# Altium schematic sheet Sheet2.SchDoc
size A2; Organization: Altium Limited; Address1: L3, 12a Rodborough Rd; Address2: Frenchs Forest; Address3: NSW; Address4: Australia 2086
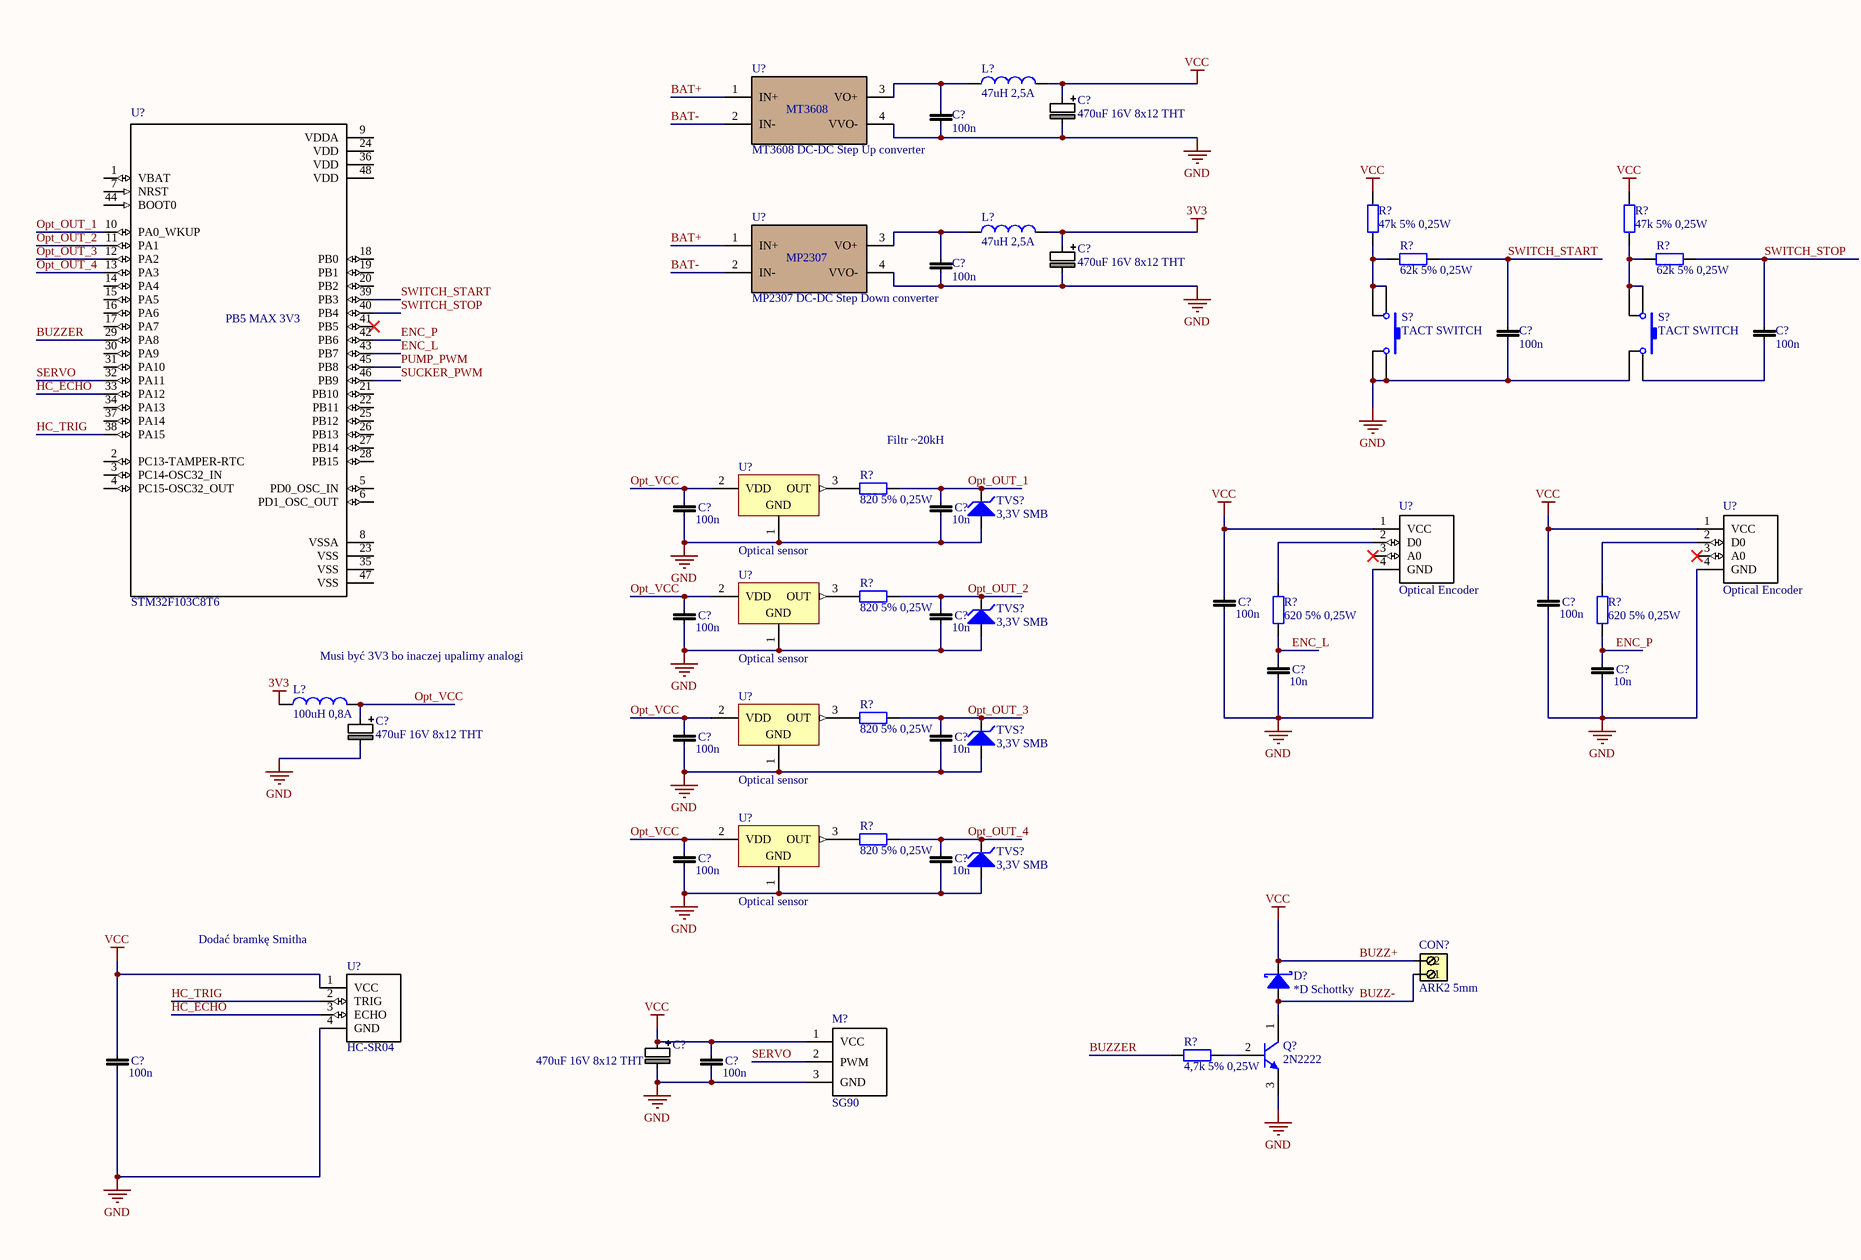
[diagram p0: Sheet2.SchDoc, left]
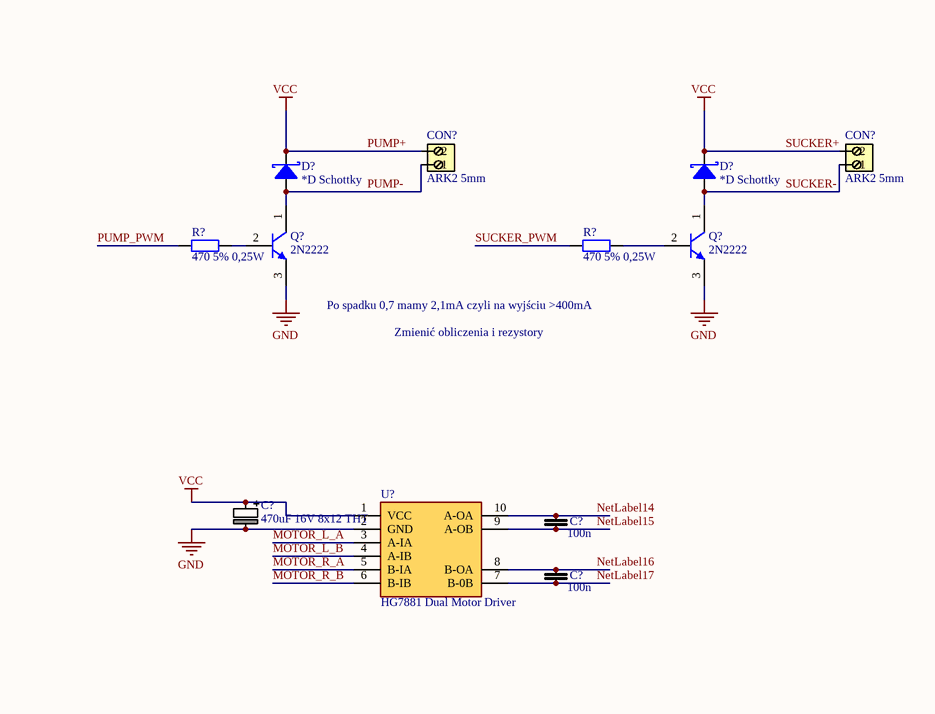
[diagram p1: Sheet2.SchDoc, right]

## Parts
(Parts that share a designator on the sheet are numbered #1, #2 ... from top to bottom, then left to right.)
C?#1  470uF 16V 8x12 THT  [EL8x12]
C?#2  100n  [C THT  FILM X2]
C?#3  470uF 16V 8x12 THT  [EL8x12]
C?#4  100n  [C THT  FILM X2]
C?#5  100n  [C THT  FILM X2]
C?#6  100n  [C THT  FILM X2]
C?#7  100n  [C THT  FILM X2]
C?#8  10n  [C THT  FILM X2]
C?#9  470uF 16V 8x12 THT  [EL8x12]
C?#10  100n  [C THT  FILM X2]
C?#11  100n  [C THT  FILM X2]
C?#12  100n  [C THT  FILM X2]
C?#13  100n  [C THT  FILM X2]
C?#14  10n  [C THT  FILM X2]
C?#15  100n  [C THT  FILM X2]
C?#16  10n  [C THT  FILM X2]
C?#17  10n  [C THT  FILM X2]
C?#18  470uF 16V 8x12 THT  [EL8x12]
C?#19  100n  [C THT  FILM X2]
C?#20  10n  [C THT  FILM X2]
C?#21  100n  [C THT  FILM X2]
C?#22  10n  [C THT  FILM X2]
C?#23  470uF 16V 8x12 THT  [EL8x12]
C?#24  100n  [C THT  FILM X2]
C?#25  100n  [C THT  FILM X2]
CON?#1  ARK2 5mm  [ARK5-2]
CON?#2  ARK2 5mm  [ARK5-2]
CON?#3  ARK2 5mm  [ARK5-2]
D?#1  *D Schottky  [SMA]
D?#2  *D Schottky  [SMA]
D?#3  *D Schottky  [SMA]
L?#1  47uH 2,5A  [MSS1278 SERIES]
L?#2  47uH 2,5A  [MSS1278 SERIES]
L?#3  100uH 0,8A  [MSS1278 SERIES]
M?  SG90
Q?#1  2N2222  [ONSC-TO-92-3-29-11]
Q?#2  2N2222  [ONSC-TO-92-3-29-11]
Q?#3  2N2222  [ONSC-TO-92-3-29-11]
R?#1  47k 5% 0,25W  [RES-15mm_0.25W]
R?#2  47k 5% 0,25W  [RES-15mm_0.25W]
R?#3  62k 5% 0,25W  [RES-15mm_0.25W]
R?#4  62k 5% 0,25W  [RES-15mm_0.25W]
R?#5  470 5% 0,25W  [RES-15mm_0.25W]
R?#6  470 5% 0,25W  [RES-15mm_0.25W]
R?#7  820 5% 0,25W  [RES-15mm_0.25W]
R?#8  820 5% 0,25W  [RES-15mm_0.25W]
R?#9  620 5% 0,25W  [RES-15mm_0.25W]
R?#10  620 5% 0,25W  [RES-15mm_0.25W]
R?#11  820 5% 0,25W  [RES-15mm_0.25W]
R?#12  820 5% 0,25W  [RES-15mm_0.25W]
R?#13  4,7k 5% 0,25W  [RES-15mm_0.25W]
S?#1  TACT SWITCH  [DTS6]
S?#2  TACT SWITCH  [DTS6]
TVS?#1  3,3V SMB  [SMB]
TVS?#2  3,3V SMB  [SMB]
TVS?#3  3,3V SMB  [SMB]
TVS?#4  3,3V SMB  [SMB]
U?#1  MT3608 DC-DC Step Up converter  [DC_DC_SINGLE]
U?#2  MP2307 DC-DC Step Down converter  [DC_DC_SINGLE]
U?#3  STM32F103C8T6  [*QFP50P900X900X160-48N]
U?#4  Optical sensor  [AMS-S-3-4600X2600_V]
U?#5  Optical Encoder
U?#6  Optical Encoder
U?#7  Optical sensor  [AMS-S-3-4600X2600_V]
U?#8  HG7881 Dual Motor Driver
U?#9  Optical sensor  [AMS-S-3-4600X2600_V]
U?#10  Optical sensor  [AMS-S-3-4600X2600_V]
U?#11  HC-SR04  [*XCVR_HC-SR04]

## Nets
3V3: C?#3.2(+) L?#2.2 L?#3.1
BUZZ+: C?#1.2(+) C?#9.2(+) C?#11.2 C?#12.2 C?#23.2(+) C?#24.2 C?#25.2 CON?#1.2 CON?#2.2 CON?#3.2 D?#1.2(K) D?#2.2(K) D?#3.2(K) L?#1.2 M?.1(VCC) R?#1.2 R?#2.2 U?#5.1(VCC) U?#6.1(VCC) U?#8.1(VCC) U?#11.1(VCC)  [also labelled PUMP+, SUCKER+, VCC]
GND: C?#1.1(-) C?#2.1 C?#3.1(-) C?#4.1 C?#5.1 C?#7.1 C?#8.1 C?#9.1(-) C?#11.1 C?#12.1 C?#13.1 C?#14.1 C?#16.1 C?#17.1 C?#18.1(-) C?#19.1 C?#20.1 C?#21.1 C?#22.1 C?#23.1(-) C?#24.1 C?#25.1 M?.3(GND) Q?#1.3(E) Q?#2.3(E) Q?#3.3(E) S?#1.3 S?#1.4 S?#2.3 TVS?#1.1(A) TVS?#2.1(A) TVS?#3.1(A) TVS?#4.1(A) U?#1.4(VVO-) U?#2.4(VVO-) U?#4.1(GND) U?#5.4(GND) U?#6.4(GND) U?#7.1(GND) U?#8.2(GND) U?#9.1(GND) U?#10.1(GND) U?#11.4(GND)
BAT+: U?#1.1(IN+) U?#2.1(IN+)
BAT-: U?#1.2(IN-) U?#2.2(IN-)
BUZZ-: CON?#3.1 D?#3.1(A) Q?#3.1(C)
BUZZER: R?#13.1 U?#3.29(PA8)
ENC_L: C?#16.2 R?#9.1 U?#3.43(PB7)
ENC_P: C?#17.2 R?#10.1 U?#3.42(PB6)
HC_ECHO: U?#3.33(PA12) U?#11.3(ECHO)
HC_TRIG: U?#3.38(PA15) U?#11.2(TRIG)
MOTOR_L_A: U?#8.3(A-IA)
MOTOR_L_B: U?#8.4(A-IB)
MOTOR_R_A: U?#8.5(B-IA)
MOTOR_R_B: U?#8.6(B-IB)
NetLabel14: C?#10.2 U?#8.10(A-OA)
NetLabel15: C?#10.1 U?#8.9(A-OB)
NetLabel16: C?#15.2 U?#8.8(B-OA)
NetLabel17: C?#15.1 U?#8.7(B-0B)
Opt_OUT_1: C?#8.2 R?#7.2 TVS?#1.2(K) U?#3.10(PA0_WKUP)
Opt_OUT_2: C?#14.2 R?#8.2 TVS?#2.2(K) U?#3.11(PA1)
Opt_OUT_3: C?#20.2 R?#11.2 TVS?#3.2(K) U?#3.12(PA2)
Opt_OUT_4: C?#22.2 R?#12.2 TVS?#4.2(K) U?#3.13(PA3)
Opt_VCC: C?#7.2 C?#13.2 C?#18.2(+) C?#19.2 C?#21.2 L?#3.2 U?#4.2(VDD) U?#7.2(VDD) U?#9.2(VDD) U?#10.2(VDD)
PUMP-: CON?#1.1 D?#1.1(A) Q?#1.1(C)
PUMP_PWM: R?#5.1 U?#3.45(PB8)
SERVO: M?.2(PWM) U?#3.32(PA11)
SUCKER-: CON?#2.1 D?#2.1(A) Q?#2.1(C)
SUCKER_PWM: R?#6.1 U?#3.46(PB9)
SWITCH_START: C?#5.2 R?#3.2 U?#3.39(PB3)
SWITCH_STOP: C?#6.2 R?#4.2 U?#3.40(PB4)
NetC?#2_2: C?#2.2 L?#1.1 U?#1.3(VO+)
NetC?#4_2: C?#4.2 L?#2.1 U?#2.3(VO+)
NetC?#6_1: C?#6.1 S?#2.4
NetQ?#1_2: Q?#1.2(B) R?#5.2
NetQ?#2_2: Q?#2.2(B) R?#6.2
NetQ?#3_2: Q?#3.2(B) R?#13.2
NetR?#1_1: R?#1.1 R?#3.1 S?#1.1 S?#1.2
NetR?#2_1: R?#2.1 R?#4.1 S?#2.1 S?#2.2
NetR?#7_1: R?#7.1 U?#4.3(OUT)
NetR?#8_1: R?#8.1 U?#7.3(OUT)
NetR?#9_2: R?#9.2 U?#5.2(D0)
NetR?#10_2: R?#10.2 U?#6.2(D0)
NetR?#11_1: R?#11.1 U?#9.3(OUT)
NetR?#12_1: R?#12.1 U?#10.3(OUT)

Not connected (* = marked no-connect by the designer): U?#3 1(VBAT) 2(PC13-TAMPER-RTC) 3(PC14-OSC32_IN) 4(PC15-OSC32_OUT) 5(PD0_OSC_IN) 6(PD1_OSC_OUT) 7(NRST) 8(VSSA) 9(VDDA) 14(PA4) 15(PA5) 16(PA6) 17(PA7) 18(PB0) 19(PB1) 20(PB2) 21(PB10) 22(PB11) 23(VSS) 24(VDD) 25(PB12) 26(PB13) 27(PB14) 28(PB15) 30(PA9) 31(PA10) 34(PA13) 35(VSS) 36(VDD) 37(PA14) 41(PB5)* 44(BOOT0) 47(VSS) 48(VDD); U?#5 3(A0)*; U?#6 3(A0)*

## Notes on the sheet
- (near U?#3) PB5 MAX 3V3
- Po spadku 0,7 mamy 2,1mA czyli na wyjściu >400mA
- Filtr ~20kH
- Zmienić obliczenia i rezystory
- Musi być 3V3 bo inaczej upalimy analogi
- (near U?#11) Dodać bramkę Smitha
- Title
- Size:
- Date:
- File:
- A2
- Number:
- Time:
- Revision:
- Sheet
- of

## Library data of the parts
C?#1 C?#3 C?#9 C?#18 C?#23 = 470uF 16V 8x12 THT El: electrolytic capacitor; Class: U; Type: C; PN Piekarz: 35886; Preferred shop: P; Tolerance: 10%; Publisher: NXT Labs; Value: 470uF; Voltage: 16V; PN TME: RD1C477M0811MBB; PN Other: *; Dielectric: electrolytic
C?#2 C?#4-C?#7 C?#10-C?#13 C?#15 C?#19 C?#21 C?#24 C?#25 = *C THT: Film Capacitor; Publisher: Kamil Pawliczak; Value: 100n; HelpURL: C:\Altium\Biblioteki\elementy_bierne\doc\kondensator.txt
C?#8 C?#14 C?#16 C?#17 C?#20 C?#22 = *C THT: Film Capacitor; Value: 100n; Publisher: Kamil Pawliczak; HelpURL: C:\Altium\Biblioteki\elementy_bierne\doc\kondensator.txt
CON?#1-CON?#3 = ARK2 5mm: ARK2 CONNECTOR; Class: U; PN Piekarz: 00561; Preferred shop: Piekarz; PN Other: *; PN TME: EBBA-02-C-SS-BU; Publisher: NXT Labs; Type: CON
D?#1-D?#3 = *D Schottky: Schottky Diode; Publisher: Kamil Pawliczak
L?#1 L?#2 = 47uH 2,5A DE 1207 POWER: SMD POWER INDUCTOR; Tolerance: 20%; PN Piekarz: 20048; Class: S; Preferred shop: Piekarz; Current: 2,5A; Type: L; Resistance: 0,1; Footprint: MSS1278 series; Publisher: NXT Labs; PN TME: DE1207-47; PN Other: *; Inductance: 47uH; Case: DE 1207
L?#3 = 100uH 1,7A DE 1207 POWER: SMD POWER INDUCTOR; Tolerance: 20%; PN Piekarz: 18200; Class: S; Preferred shop: Piekarz; Current: 1,7A; Type: L; Resistance: 0,22; Footprint: MSS1278 series; Publisher: NXT Labs; PN TME: DE1207-100; PN Other: *; Inductance: 100uH; Case: DE 1207
M? = SG90 servo: SG90 micro servo; Class: S; Footprint: *; PN Other: *; PN Piekarz: *; PN TME: *; Preferred shop: *; Type: U; Publisher: NXT Labs
Q?#1-Q?#3 = CMP-1048-01402-1: Amplifier Transistor, NPN Silicon, 3-Pin TO-92, Pb-Free, Bulk Box; PartNumber: P2N2222AG; Manufacturer: On Semiconductor; IC Continuous (A): 0.6; fT Min (MHz): 300; ComponentLink2Description: Datasheet; ComponentLink1Description: Manufacturer URL; ComponentLink2URL: http://www.onsemi.com/pub_link/Collateral/P2N2222A-D.PDF; ComponentLink3Description: Package Specification; RoHS: TRUE; ComponentLink1URL: http://www.onsemi.com/; Mounting Technology: Through Hole; PackageReference: TO-92-3-29-11_AM_SL; Polarity: NPN; Packing: Bulk Box; DatasheetVersion: Rev. 7; PackageDescription: 3-Pin Transistor Outline, Body 4.825 x 3.685 mm, Pitch 1.27 mm; PackageVersion: Rev. AM; ComponentLink3URL: http://www.onsemi.cn/pub_link/Collateral/2N6426-D.PDF
R?#1-R?#13 = 470 5% 0,25W H 15mm: Tht resistor; Value: 470; PN Piekarz: 03311; Preferred shop: P; Class: U; PD: 0,25W; Publisher: NXT Labs; Type: R; PN TME: CF1/4W-470R; PN Other: *; Tolerance: 5%
S?#1 S?#2 = TACT SWITCH: 6x6mm Switch; Publisher: Kamil Pawliczak; ComponentLink1Description: DTS6 - Dokumentacja; ComponentLink1URL: C:\Altium\Biblioteki\elementy_stykowe\doc\dts6.pdf
TVS?#1-TVS?#4 = TVS 3,3V l SMB: Smd TVS; Class: U; PN Piekarz: 22690; Preferred shop: P; Voltage: 3,3V; PD: 600W; Tolerance: 5%; Publisher: NXT Labs; PN Other: *; PN TME: *; Type: TVS
U?#1 = MT3608: MT3608 DC-DC Step Up converter 2A 1.2MHz; Publisher: Kamil Pawliczak
U?#2 = MP2307: MT3608 DC-DC Step Down converter 1.8A 340kHz 1-17V; Publisher: Kamil Pawliczak
U?#3 = STM32F103C8T6: Mainstream Performance line, ARM Cortex-M3 MCU with 64 Kbytes Flash, 72 MHz CPU, motor control, USB and CAN; MF: STMicroelectronics; Price: None; MP: STM32F103C8T6; SnapEDA_Link: https://www.snapeda.com/parts/STM32F103C8T6/STMicroelectronics/view-part/?ref=snap; Package: LQFP-48 STMicroelectronics; Availability: Unavailable; Value: *
U?#4 U?#7 U?#9 U?#10 = CMP-0550-00065-2: IR Light-to-Voltage Converter - Fast Response and Low-Noise, S-3, Pb-Free; Manufacturer: AMS; PartNumber: TSL262R-LF; Fast Response Time: TRUE; Responsivity Wavelength (nm): 940; Operating Voltage (V): 2.7-5.5; ComponentLink1Description: Manufacturer URL; Low Noise: TRUE; ComponentLink2URL: http://www.ams.com/eng/content/download/250430/976493/142386; PackageDescription: 3-Pin Plastic Single In Line Side Looker Package, 4.6 x 2.6 mm Body, 2 mm Pitch; PackageReference: S-3; Mounting Technology: Through Hole; PackageVersion: TAOS052J, 09/2008; DatasheetVersion: TAOS049E; ComponentLink1URL: www.ams.com; ComponentLink2Description: Datasheet
U?#5 U?#6 = Optical Encoder: Encoder; Class: S; Preferred shop: P; Footprint: *; PN Other: *; PN Piekarz: *; PN TME: *; Type: U; Publisher: NXT Labs
U?#8 = HG7881 Dual Motor Driver: Dual Motor Driver; Class: S; Footprint: *; PN Other: *; PN Piekarz: *; PN TME: *; Preferred shop: *; Type: U; Publisher: NXT Labs
U?#11 = HC-SR04: HC-SR04 Ultrasonic Sensor For Arduino And Raspberry Pi HC-SR04 Ultrasonic Sensor For Arduino And Raspberry Pi; MF: Adafruit Industries; SnapEDA_Link: https://www.snapeda.com/parts/HC-SR04/Adafruit%20Industries%20LLC/view-part/?ref=snap; Price: None; Availability: Unavailable; Package: None; MP: HC-SR04; Value: *